# Altium schematic sheet GSM SA Schematic.SchDoc
size A3; SheetNumber: 1; SheetTotal: 2
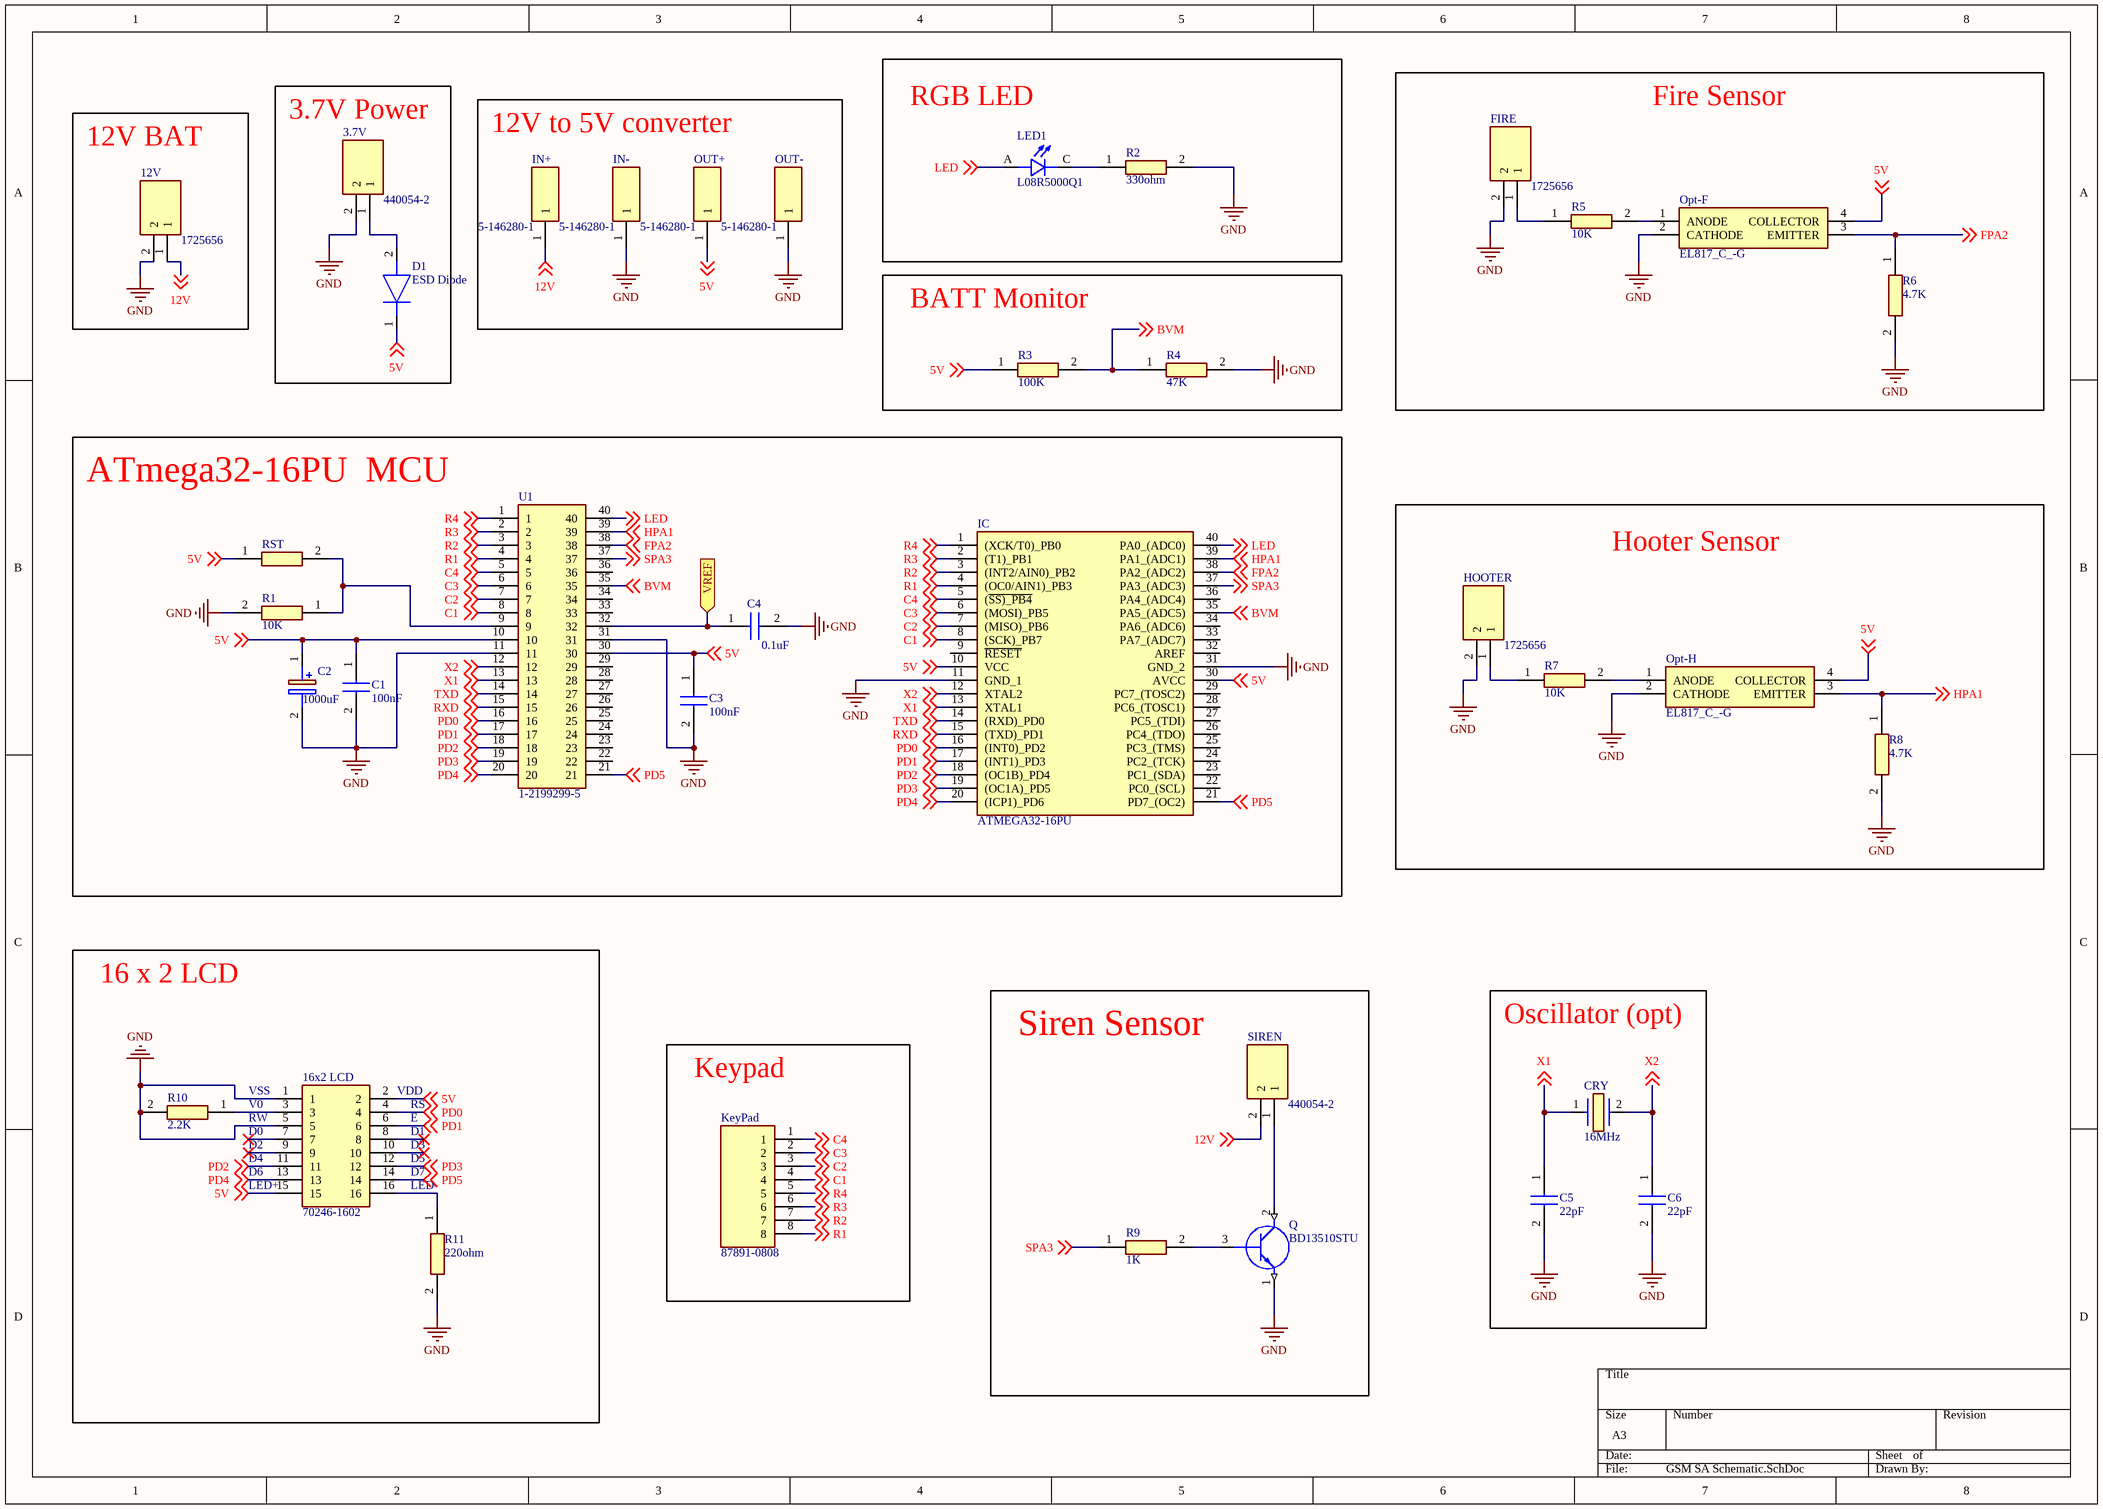
[diagram p0: GSM SA Schematic.SchDoc]

## Parts
3.7V  440054-2  [SHDR2W70P0X200_1X2_600X470X635P]
12V  1725656  [1725656]
16x2_LCD  70246-1602  [SHDR16W99P254_2X8_2794X889X927P]
C1  100nF  [C1206]
C2  1000uF  [CAPPRD500W65D1000H1750]
C3  100nF  [C1206]
C4  0.1uF  [C1206]
C5  22pF  [C1206]
C6  22pF  [C1206]
CRY  16MHz  [ECS160185PXGMTR]
D1  ESD Diode  [DIOM5336X262N]
FIRE  1725656  [1725656]
HOOTER  1725656  [1725656]
IC  ATMEGA32-16PU  [DIP1556W56P254L5232H483Q40N]
IN+  5-146280-1  [HDRV1W67P0X254_1X1_213X234X821P]
IN-  5-146280-1  [HDRV1W67P0X254_1X1_213X234X821P]
KeyPad  87891-0808  [HDRV8W69P0X254_1X8_2032X251X1641P]
LED1  L08R5000Q1  [LEDRD254W57D500H1070]
Opt-F  EL817_C_-G  [DIP762W60P254L458H480Q4N]
Opt-H  EL817_C_-G  [DIP762W60P254L458H480Q4N]
OUT+  5-146280-1  [HDRV1W67P0X254_1X1_213X234X821P]
OUT-  5-146280-1  [HDRV1W67P0X254_1X1_213X234X821P]
Q  BD13510STU  [TO229P345X800X1460-3P]
R1  10K  [RESC3216X65N]
R2  330ohm  [RESC3216X65N]
R3  100K  [RESC3216X65N]
R4  47K  [RESC3216X65N]
R5  10K  [RESC3216X65N]
R6  4.7K  [RESC3216X65N]
R7  10K  [RESC3216X65N]
R8  4.7K  [RESC3216X65N]
R9  1K  [RESC3116X65N]
R10  2.2K  [RESC3216X65N]
R11  220ohm  [RESC3216X65N]
RST  NP  [RESC3216X65N]  (value not drawn)
SIREN  440054-2  [SHDR2W70P0X200_1X2_600X470X635P]
U1  1-2199299-5  [DIPS1544W70P254L5080H530Q40N]

## Blocks framed on the sheet
RGB LED: LED1 R2
12V BAT: 12V
3.7V Power: 3.7V D1
12V to 5V converter: IN+ IN- OUT+ OUT-
Fire Sensor: FIRE Opt-F R5 R6
BATT Monitor: R3 R4
ATmega32-16PU  MCU: C1-C4 IC R1 RST U1
Hooter Sensor: HOOTER Opt-H R7 R8
16 x 2 LCD: 16x2_LCD R10 R11
Siren Sensor: Q R9 SIREN
Oscillator (opt): C5 C6 CRY
Keypad: KeyPad

## Ports
VREF (in)

## Nets
GND: 3.7V.2 12V.2 16x2_LCD.1 16x2_LCD.5 C1.2 C2.2(-) C3.2 C4.2 C5.2 C6.2 FIRE.2 HOOTER.2 IC.11(GND_1) IC.31(GND_2) IN-.1 Opt-F.2(CATHODE) Opt-H.2(CATHODE) OUT-.1 Q.1(E) R1.2 R2.2 R4.2 R6.2 R8.2 R10.2 R11.2 U1.11 U1.31
5V: 16x2_LCD.2 16x2_LCD.15 C1.1 C2.1(+) C3.1 D1.1(K) IC.10(VCC) IC.30(AVCC) Opt-F.4(COLLECTOR) Opt-H.4(COLLECTOR) OUT+.1 R3.1 RST.1 U1.10 U1.30 ; off-sheet 5V
12V: 12V.1 IN+.1 SIREN.2 ; off-sheet 12V
BVM: IC.35(PA5_(ADC5)) R3.2 R4.1 U1.35 ; off-sheet BVM
C1: IC.8((SCK)_PB7) KeyPad.4 U1.8 ; off-sheet C1
C2: IC.7((MISO)_PB6) KeyPad.3 U1.7 ; off-sheet C2
C3: IC.6((MOSI)_PB5) KeyPad.2 U1.6 ; off-sheet C3
C4: IC.5((~{SS)_PB4}) KeyPad.1 U1.5 ; off-sheet C4
FPA2: IC.38(PA2_(ADC2)) Opt-F.3(EMITTER) R6.1 U1.38 ; off-sheet FPA2
HPA1: IC.39(PA1_(ADC1)) Opt-H.3(EMITTER) R8.1 U1.39 ; off-sheet HPA1
LED: IC.40(PA0_(ADC0)) LED1.A U1.40 ; off-sheet LED
PD0: 16x2_LCD.4 IC.16((INT0)_PD2) U1.16 ; off-sheet PD0
PD1: 16x2_LCD.6 IC.17((INT1)_PD3) U1.17 ; off-sheet PD1
PD2: 16x2_LCD.11 IC.18((OC1B)_PD4) U1.18 ; off-sheet PD2
PD3: 16x2_LCD.12 IC.19((OC1A)_PD5) U1.19 ; off-sheet PD3
PD4: 16x2_LCD.13 IC.20((ICP1)_PD6) U1.20 ; off-sheet PD4
PD5: 16x2_LCD.14 IC.21(PD7_(OC2)) U1.21 ; off-sheet PD5
R1: IC.4((OC0/AIN1)_PB3) KeyPad.8 U1.4 ; off-sheet R1
R2: IC.3((INT2/AIN0)_PB2) KeyPad.7 U1.3 ; off-sheet R2
R3: IC.2((T1)_PB1) KeyPad.6 U1.2 ; off-sheet R3
R4: IC.1((XCK/T0)_PB0) KeyPad.5 U1.1 ; off-sheet R4
RXD: IC.15((TXD)_PD1) U1.15 ; off-sheet RXD
SPA3: IC.37(PA3_(ADC3)) R9.1 U1.37 ; off-sheet SPA3
TXD: IC.14((RXD)_PD0) U1.14 ; off-sheet TXD
VREF: C4.1 U1.32 ; port VREF
X1: C5.1 CRY.1 IC.13(XTAL1) U1.13 ; off-sheet X1
X2: C6.1 CRY.2 IC.12(XTAL2) U1.12 ; off-sheet X2
Net3.7V_1: 3.7V.1 D1.2(A)
Net16x2_LCD_3: 16x2_LCD.3 R10.1
Net16x2_LCD_16: 16x2_LCD.16 R11.1
NetFIRE_1: FIRE.1 R5.1
NetHOOTER_1: HOOTER.1 R7.1
NetLED1_C: LED1.C R2.1
NetOpt-F_1: Opt-F.1(ANODE) R5.2
NetOpt-H_1: Opt-H.1(ANODE) R7.2
NetQ_2: Q.2(C) SIREN.1
NetQ_3: Q.3(B) R9.2
NetR1_1: R1.1 RST.2 U1.9

Not connected (* = marked no-connect by the designer): 16x2_LCD 7* 8* 9* 10*; IC 9(~{RESET}) 22(PC0_(SCL)) 23(PC1_(SDA)) 24(PC2_(TCK)) 25(PC3_(TMS)) 26(PC4_(TDO)) 27(PC5_(TDI)) 28(PC6_(TOSC1)) 29(PC7_(TOSC2)) 32(AREF) 33(PA7_(ADC7)) 34(PA6_(ADC6)) 36(PA4_(ADC4)); U1 22 23 24 25 26 27 28 29 33 34 36

## Notes on the sheet
- VSS
- V0
- RW
- (near 16x2_LCD) VDD
- (near 16x2_LCD) RS
- (near 16x2_LCD) E
- D0
- D2
- D4
- (near 16x2_LCD) D6
- (near 16x2_LCD) LED+
- (near 16x2_LCD) D1
- (near 16x2_LCD) D3
- (near 16x2_LCD) D5
- D7
- LED-

## Library data of the parts
3.7V SIREN = 440054-2: Connector; Manufacturer_Name: TE Connectivity; Datasheet Link: https://www.te.com/commerce/DocumentDelivery/DDEController?Action=showdoc&DocId=Customer+Drawing%7F440054%7FF8%7Fpdf%7FEnglish%7FENG_CD_440054_F8.pdf%7F1-440054-2; Height: 6.35mm; Manufacturer_Part_Number: 440054-2; Mouser Part Number: 571-440054-2; Mouser Price/Stock: https://www.mouser.co.uk/ProductDetail/TE-Connectivity/440054-2?qs=JFPmFzpscO4RQaczYEA68w%3D%3D; Arrow Part Number: 440054-2; Arrow Price/Stock: https://www.arrow.com/en/products/440054-2/te-connectivity?region=europe
12V FIRE HOOTER = 1725656: Connector; Manufacturer_Name: Phoenix Contact; Datasheet Link: https://www.phoenixcontact.com/online/portal/us/?uri=pxc-oc-itemdetail:pid=1725656&library=usen&pcck=P-11-01-05&tab=1&selectedCategory=ALL; Height: 8.65mm; Manufacturer_Part_Number: 1725656; Mouser Part Number: 651-1725656; Mouser Price/Stock: https://www.mouser.co.uk/ProductDetail/Phoenix-Contact/1725656?qs=Ul7CXFMnlWWQeccayYbRmw%3D%3D; Arrow Part Number: 1725656; Arrow Price/Stock: https://www.arrow.com/en/products/1725656/phoenix-contact?region=nac
16x2_LCD = 70246-1602: Headers & Wire Housings 2.54mm CGrid Hdr Shr d /Slt .76AuLF 16Ckt; Manufacturer_Name: Molex; Geometry.Height: 9.27mm; Mouser Part Number: 538-70246-1602; Mouser Price/Stock: https://www.mouser.co.uk/ProductDetail/Molex/70246-1602?qs=Y%2FrI5Y8Al89vLxTpaytoaQ%3D%3D; Manufacturer_Part_Number: 70246-1602; Datasheet Link: https://www.molex.com/pdm_docs/sd/702461602_sd.pdf
C1 C3 = C1206C150F5GACTU: 100nF 5% tolerance 50VDC Capacitor; Manufacturer_Name: KEMET; Datasheet Link: https://content.kemet.com/datasheets/KEM_C1003_C0G_SMD.pdf; Manufacturer_Part_Number: C1206C150F5GACTU; Mouser Part Number: 80-C1206C150F5GACTU; Mouser Price/Stock: https://www.mouser.co.uk/ProductDetail/KEMET/C1206C150F5GACTU?qs=ds50AKTGxA8Yi2FrC9bQqw%3D%3D
C2 = EEU-HD1E102B: 1000uF 25VDC Capacitor Polarised; Manufacturer_Name: Panasonic; Datasheet Link: http://industrial.panasonic.com/cdbs/www-data/pdf/RDF0000/ABA0000C1035.pdf; Height: 17.5mm; Manufacturer_Part_Number: EEU-HD1E102B; Mouser Part Number: 667-EEU-HD1E102B; Mouser Price/Stock: https://www.mouser.com/Search/Refine.aspx?Keyword=667-EEU-HD1E102B; Arrow Part Number: EEU-HD1E102B; Arrow Price/Stock: https://www.arrow.com/en/products/eeu-hd1e102b/panasonic
C4 = C1206C150F5GACTU: 0.1uF 5% tolerance 50VDC Capacitor; Manufacturer_Name: KEMET; Datasheet Link: https://content.kemet.com/datasheets/KEM_C1003_C0G_SMD.pdf; Manufacturer_Part_Number: C1206C150F5GACTU; Mouser Part Number: 80-C1206C150F5GACTU; Mouser Price/Stock: https://www.mouser.co.uk/ProductDetail/KEMET/C1206C150F5GACTU?qs=ds50AKTGxA8Yi2FrC9bQqw%3D%3D
C5 C6 = C1206C150F5GACTU: 22pF 10% tolerance 50VDC tolerance Capacitor; Manufacturer_Name: KEMET; Datasheet Link: https://content.kemet.com/datasheets/KEM_C1003_C0G_SMD.pdf; Manufacturer_Part_Number: C1206C150F5GACTU; Mouser Part Number: 80-C1206C150F5GACTU; Mouser Price/Stock: https://www.mouser.co.uk/ProductDetail/KEMET/C1206C150F5GACTU?qs=ds50AKTGxA8Yi2FrC9bQqw%3D%3D
CRY = ECS-160-18-5PX-GM-TR: Crystal or Oscillator; Manufacturer_Name: ECS; Datasheet Link: https://www.mouser.com/datasheet/2/122/csm_7x-1841291.pdf; Height: 4.3mm; Manufacturer_Part_Number: ECS-160-18-5PX-GM-TR; Mouser Part Number: 520-160-18-5PX-GM-TR; Mouser Price/Stock: https://www.mouser.co.uk/ProductDetail/ECS/ECS-160-18-5PX-GM-TR?qs=amGC7iS6iy9jy4CztfLIlw%3D%3D
D1 = SMBJ5.0CA-13-F: ESD Suppressors / TVS Diodes 600W 5.0V; Manufacturer_Name: Diodes Incorporated; Datasheet Link: http://uk.rs-online.com/web/p/products/1222405; Height: 2.62mm; Manufacturer_Part_Number: SMBJ5.0CA-13-F; Mouser Part Number: 621-SMBJ5.0CA-13-F; Mouser Price/Stock: https://www.mouser.co.uk/ProductDetail/Diodes-Incorporated/SMBJ5.0CA-13-F?qs=gaDBXWSqsDAkxXz1%252BnNiVg%3D%3D; Arrow Part Number: SMBJ5.0CA-13-F; Arrow Price/Stock: https://www.arrow.com/en/products/smbj5.0ca-13-f/diodes-incorporated?region=nac
IC = ATMEGA32-16PU: Integrated Circuit; Manufacturer_Name: Microchip; Datasheet Link: https://datasheet.datasheetarchive.com/originals/distributors/Datasheets_SAMA/d5bf27914111a61a5f5ef80f30f6d660.pdf; Height: 4.826mm; Manufacturer_Part_Number: ATMEGA32-16PU; Mouser Part Number: 556-ATMEGA32-16PU; Mouser Price/Stock: https://www.mouser.co.uk/ProductDetail/Microchip-Technology/ATMEGA32-16PU?qs=aqrrBurbvGdpkmgj7RWmsQ%3D%3D; Arrow Part Number: ATMEGA32-16PU; Arrow Price/Stock: https://www.arrow.com/en/products/atmega32-16pu/microchip-technology?region=nac
IN+ IN- OUT+ OUT- = 5-146280-1: AMP - TE CONNECTIVITY - 5-146280-1 - 01 MODII HDR SRST B/A LF; Geometry.Height: 8.21mm; Mouser Part Number: 571-51462801; Mouser Price/Stock: https://www.mouser.co.uk/ProductDetail/TE-Connectivity/5-146280-1?qs=bwpFY26eRVcArW7BMMLddw%3D%3D; Manufacturer_Name: TE Connectivity; Manufacturer_Part_Number: 5-146280-1; Datasheet Link: https://www.te.com/commerce/DocumentDelivery/DDEController?Action=showdoc&DocId=Customer+Drawing%7F146280%7FH2%7Fpdf%7FEnglish%7FENG_CD_146280_H2.pdf%7F5-146280-1
KeyPad = 87891-0808: Connector; Manufacturer_Name: Molex; Datasheet Link: https://www.molex.com/pdm_docs/sd/878910808_sd.pdf; Height: 16.41mm; Manufacturer_Part_Number: 87891-0808; Mouser Part Number: 538-87891-0808; Mouser Price/Stock: https://www.mouser.co.uk/ProductDetail/Molex/87891-0808?qs=iLbezkQI%252Bsh%252BavKMBAJgwA%3D%3D
LED1 = L08R5000Q1: LED, 5MM, ORANGE; LED / Lamp Size: 5mm / T-1 3/4; LED Colour: Orange; Typ Luminous Intensity: 4.3mcd; Viewing Angle: ...; MF: LED Technology; Value: *; SnapEDA_Link: https://www.snapeda.com/parts/L08R5000Q1/LED+Technology/view-part/?ref=snap; MP: L08R5000Q1; Check_prices: https://www.snapeda.com/parts/L08R5000Q1/LED+Technology/view-part/?ref=eda; Availability: In Stock; Price: None; Package: None
Opt-F Opt-H = EL817_C_-G: Integrated Circuit; Manufacturer_Name: Everlight; Manufacturer_Part_Number: EL817(C)-G; Datasheet Link: https://componentsearchengine.com/Datasheets/1/EL817(C)-G.pdf; Height: 4.8mm; Mouser Part Number: 638-EL817C-G; Mouser Price/Stock: https://www.mouser.co.uk/ProductDetail/Everlight/EL817C-G?qs=8PzhAHr7IdMbkL15850MTg%3D%3D; Arrow Part Number: EL817(C)-G; Arrow Price/Stock: https://www.arrow.com/en/products/el817-c-g/everlight-electronics?region=nac
Q = BD13510STU: Transistor BJT NPN; Manufacturer_Name: onsemi; Datasheet Link: https://datasheet.datasheetarchive.com/originals/distributors/Datasheets_SAMA/6000e099be6481169b0ff4f49553d5da.pdf; Height: 3.45mm; Manufacturer_Part_Number: BD13510STU; Mouser Part Number: 512-BD13510STU; Mouser Price/Stock: https://www.mouser.co.uk/ProductDetail/onsemi-Fairchild/BD13510STU?qs=XVly9zr84oIAutVRL%2FrhQQ%3D%3D; Arrow Part Number: BD13510STU; Arrow Price/Stock: https://www.arrow.com/en/products/bd13510stu/on-semiconductor?region=nac
R1 R5 R7 = TNPW12065K00BEEN: 10K 1% tolerance Resistor; Manufacturer_Name: Vishay; Datasheet Link: https://www.mouser.co.uk/ProductDetail/Vishay-Dale/TNPW12065K00BEEN/?qs=jYh4YNbhoK0CHBzi35%2Fb3A%3D%3D; Height: 0.65mm; Manufacturer_Part_Number: TNPW12065K00BEEN; Mouser Part Number: 71-TNPW12065K00BEEN; Mouser Price/Stock: https://www.mouser.co.uk/ProductDetail/Vishay-Dale/TNPW12065K00BEEN/?qs=jYh4YNbhoK0CHBzi35%2Fb3A%3D%3D
R2 = TNPW12065K00BEEN: 330ohm 1% Tolerance Resistor; Manufacturer_Name: Vishay; Datasheet Link: https://www.mouser.co.uk/ProductDetail/Vishay-Dale/TNPW12065K00BEEN/?qs=jYh4YNbhoK0CHBzi35%2Fb3A%3D%3D; Height: 0.65mm; Manufacturer_Part_Number: TNPW12065K00BEEN; Mouser Part Number: 71-TNPW12065K00BEEN; Mouser Price/Stock: https://www.mouser.co.uk/ProductDetail/Vishay-Dale/TNPW12065K00BEEN/?qs=jYh4YNbhoK0CHBzi35%2Fb3A%3D%3D
R3 = TNPW12065K00BEEN: 100K 1% tolerance Resistor; Manufacturer_Name: Vishay; Datasheet Link: https://www.mouser.co.uk/ProductDetail/Vishay-Dale/TNPW12065K00BEEN/?qs=jYh4YNbhoK0CHBzi35%2Fb3A%3D%3D; Height: 0.65mm; Manufacturer_Part_Number: TNPW12065K00BEEN; Mouser Part Number: 71-TNPW12065K00BEEN; Mouser Price/Stock: https://www.mouser.co.uk/ProductDetail/Vishay-Dale/TNPW12065K00BEEN/?qs=jYh4YNbhoK0CHBzi35%2Fb3A%3D%3D
R4 = TNPW12065K00BEEN: 47K 1% tolerance Resistor; Manufacturer_Name: Vishay; Datasheet Link: https://www.mouser.co.uk/ProductDetail/Vishay-Dale/TNPW12065K00BEEN/?qs=jYh4YNbhoK0CHBzi35%2Fb3A%3D%3D; Height: 0.65mm; Manufacturer_Part_Number: TNPW12065K00BEEN; Mouser Part Number: 71-TNPW12065K00BEEN; Mouser Price/Stock: https://www.mouser.co.uk/ProductDetail/Vishay-Dale/TNPW12065K00BEEN/?qs=jYh4YNbhoK0CHBzi35%2Fb3A%3D%3D
R6 = TNPW12065K00BEEN: 4.7K 1% tolerance  Resistor; Manufacturer_Name: Vishay; Datasheet Link: https://www.mouser.co.uk/ProductDetail/Vishay-Dale/TNPW12065K00BEEN/?qs=jYh4YNbhoK0CHBzi35%2Fb3A%3D%3D; Height: 0.65mm; Manufacturer_Part_Number: TNPW12065K00BEEN; Mouser Part Number: 71-TNPW12065K00BEEN; Mouser Price/Stock: https://www.mouser.co.uk/ProductDetail/Vishay-Dale/TNPW12065K00BEEN/?qs=jYh4YNbhoK0CHBzi35%2Fb3A%3D%3D
R8 = TNPW12065K00BEEN: 4.7K 1% tolerance Resistor; Manufacturer_Name: Vishay; Datasheet Link: https://www.mouser.co.uk/ProductDetail/Vishay-Dale/TNPW12065K00BEEN/?qs=jYh4YNbhoK0CHBzi35%2Fb3A%3D%3D; Height: 0.65mm; Manufacturer_Part_Number: TNPW12065K00BEEN; Mouser Part Number: 71-TNPW12065K00BEEN; Mouser Price/Stock: https://www.mouser.co.uk/ProductDetail/Vishay-Dale/TNPW12065K00BEEN/?qs=jYh4YNbhoK0CHBzi35%2Fb3A%3D%3D
R9 = CMP1206-FX-1001ELF: 1k 1% tolerance Resistor; Manufacturer_Name: Bourns; Datasheet Link: https://pt.mouser.com/datasheet/2/54/Bourns_CMP_Datasheet_05.28.20-1854233.pdf; Height: 0.65mm; Manufacturer_Part_Number: CMP1206-FX-1001ELF; Mouser Part Number: 652-CMP1206-FX-1001L; Mouser Price/Stock: https://www.mouser.co.uk/ProductDetail/Bourns/CMP1206-FX-1001ELF?qs=TiOZkKH1s2QqK9iocF6aGg%3D%3D
R10 = TNPW12065K00BEEN: 2.2K 1% tolerance Resistor; Manufacturer_Name: Vishay; Datasheet Link: https://www.mouser.co.uk/ProductDetail/Vishay-Dale/TNPW12065K00BEEN/?qs=jYh4YNbhoK0CHBzi35%2Fb3A%3D%3D; Height: 0.65mm; Manufacturer_Part_Number: TNPW12065K00BEEN; Mouser Part Number: 71-TNPW12065K00BEEN; Mouser Price/Stock: https://www.mouser.co.uk/ProductDetail/Vishay-Dale/TNPW12065K00BEEN/?qs=jYh4YNbhoK0CHBzi35%2Fb3A%3D%3D
R11 = TNPW12065K00BEEN: 220ohm 1% tolerance Resistor; Manufacturer_Name: Vishay; Datasheet Link: https://www.mouser.co.uk/ProductDetail/Vishay-Dale/TNPW12065K00BEEN/?qs=jYh4YNbhoK0CHBzi35%2Fb3A%3D%3D; Height: 0.65mm; Manufacturer_Part_Number: TNPW12065K00BEEN; Mouser Part Number: 71-TNPW12065K00BEEN; Mouser Price/Stock: https://www.mouser.co.uk/ProductDetail/Vishay-Dale/TNPW12065K00BEEN/?qs=jYh4YNbhoK0CHBzi35%2Fb3A%3D%3D
RST = TNPW12065K00BEEN: 2 pin Switch; Manufacturer_Name: Vishay; Datasheet Link: https://www.mouser.co.uk/ProductDetail/Vishay-Dale/TNPW12065K00BEEN/?qs=jYh4YNbhoK0CHBzi35%2Fb3A%3D%3D; Height: 0.65mm; Manufacturer_Part_Number: TNPW12065K00BEEN; Mouser Part Number: 71-TNPW12065K00BEEN; Mouser Price/Stock: https://www.mouser.co.uk/ProductDetail/Vishay-Dale/TNPW12065K00BEEN/?qs=jYh4YNbhoK0CHBzi35%2Fb3A%3D%3D
U1 = 1-2199299-5: Connector; Manufacturer_Name: TE Connectivity; Datasheet Link: https://www.te.com/commerce/DocumentDelivery/DDEController?Action=showdoc&DocId=Customer+Drawing%7F2199299%7FA%7Fpdf%7FEnglish%7FENG_CD_2199299_A_baseFilename.pdf%7F1-2199299-5; Height: 5.3mm; Manufacturer_Part_Number: 1-2199299-5; Mouser Part Number: 571-1-2199299-5; Mouser Price/Stock: https://www.mouser.co.uk/ProductDetail/TE-Connectivity/1-2199299-5?qs=fK8dlpkaUMthXjoyadQV1Q%3D%3D; Arrow Part Number: 1-2199299-5; Arrow Price/Stock: https://www.arrow.com/en/products/1-2199299-5/te-connectivity?region=europe